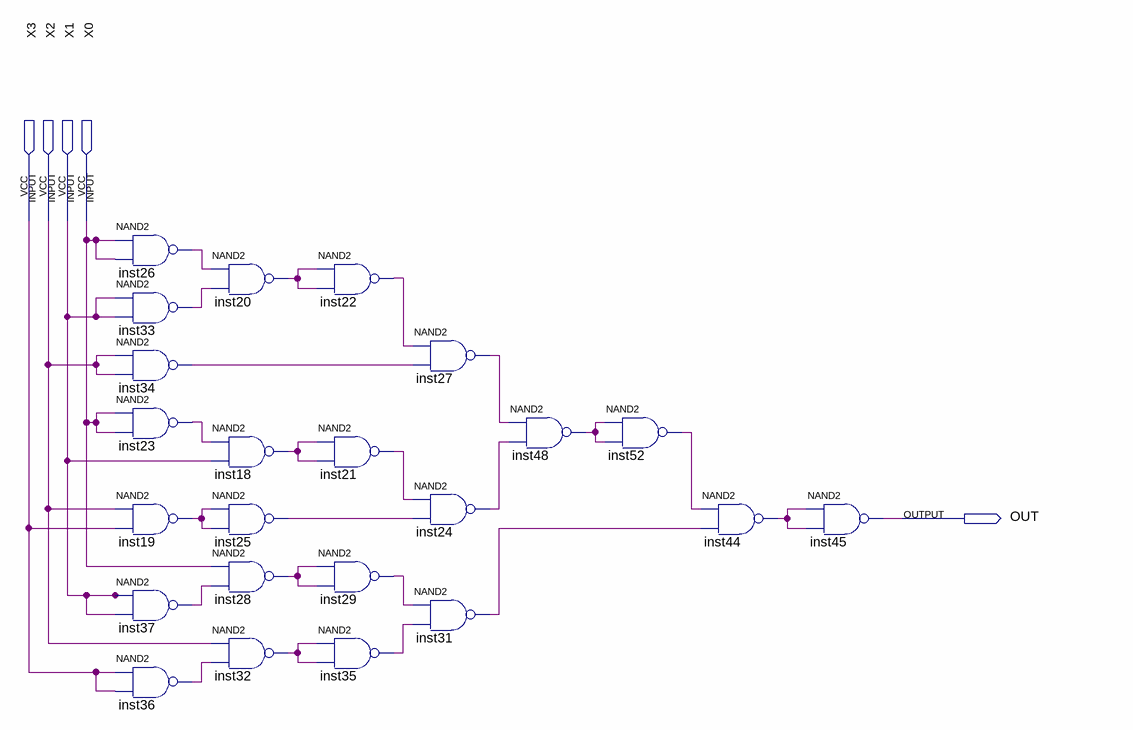
[diagram p0: schematic sheet]
// Quartus schematic G.bdf as structural Verilog: 23 symbols, 5 pins
module G (
  input  X3,
  input  X2,
  input  X1,
  input  X0,
  output OUT
);

  wire inst18_out, inst19_out, inst20_out, inst21_out, inst22_out, inst23_out, inst24_out, inst25_out,
       inst26_out, inst27_out, inst28_out, inst29_out, inst31_out, inst32_out, inst33_out, inst34_out,
       inst35_out, inst36_out, inst37_out, inst44_out, inst48_out, inst52_out;

  nand inst26 (inst26_out, X0, X0);
  nand inst33 (inst33_out, X1, X1);
  nand inst34 (inst34_out, X2, X2);
  nand inst23 (inst23_out, X0, X0);
  nand inst19 (inst19_out, X2, X3);
  nand inst37 (inst37_out, X1, X1);
  nand inst36 (inst36_out, X3, X3);
  nand inst20 (inst20_out, inst26_out, inst33_out);
  nand inst18 (inst18_out, inst23_out, X1);
  nand inst25 (inst25_out, inst19_out, inst19_out);
  nand inst28 (inst28_out, X0, inst37_out);
  nand inst32 (inst32_out, X2, inst36_out);
  nand inst22 (inst22_out, inst20_out, inst20_out);
  nand inst21 (inst21_out, inst18_out, inst18_out);
  nand inst29 (inst29_out, inst28_out, inst28_out);
  nand inst35 (inst35_out, inst32_out, inst32_out);
  nand inst27 (inst27_out, inst22_out, inst34_out);
  nand inst24 (inst24_out, inst21_out, inst25_out);
  nand inst31 (inst31_out, inst29_out, inst35_out);
  nand inst48 (inst48_out, inst27_out, inst24_out);
  nand inst52 (inst52_out, inst48_out, inst48_out);
  nand inst44 (inst44_out, inst52_out, inst31_out);
  nand inst45 (OUT, inst44_out, inst44_out);
endmodule
